# Altium schematic sheet FE.SchDoc: ThunderScope 1000E
size A4; Revision: 1
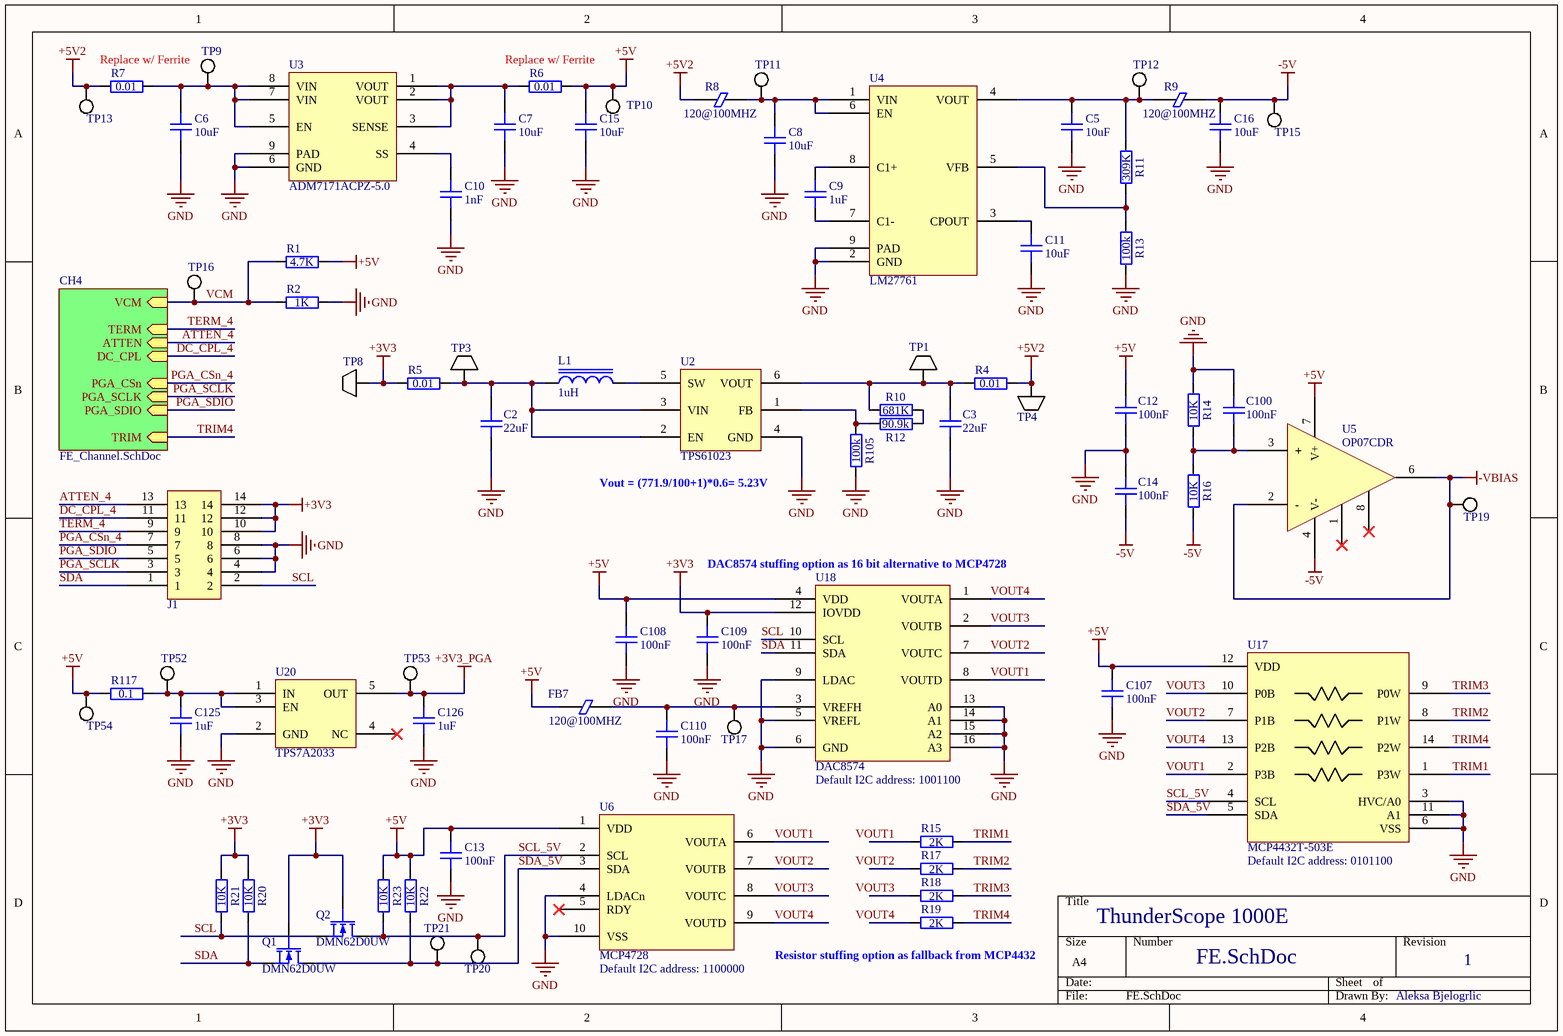
[diagram p0: FE.SchDoc]

## Parts
C2  22uF  [GEN_C_0805]
C3  22uF  [GEN_C_0805]
C5  10uF  [GEN_C_0603]
C6  10uF  [GEN_C_0603]
C7  10uF  [GEN_C_0603]
C8  10uF  [GEN_C_0603]
C9  1uF  [GEN_C_0402]
C10  1nF  [GEN_C_0402]
C11  10uF  [GEN_C_0603]
C12  100nF  [GEN_C_0402]
C13  100nF  [GEN_C_0402]
C14  100nF  [GEN_C_0402]
C15  10uF  [GEN_C_0603]
C16  10uF  [GEN_C_0603]
C100  100nF  [GEN_C_0402]
C107  100nF  [GEN_C_0402]
C108  100nF  [GEN_C_0402]
C109  100nF  [GEN_C_0402]
C110  100nF  [GEN_C_0402]
C125  1uF  [GEN_C_0402]
C126  1uF  [GEN_C_0402]
FB7  120@100MHZ  [GEN_R_0402]
J1  2.54mm 2X7 Pin TH  [GEN_2.54mm_2X7_Pin_TH_RA]  (value not drawn)
L1  1uH  [GEN_L_1210]
Q1  DMN62D0UW  [GEN_SOT_323]
Q2  DMN62D0UW  [GEN_SOT_323]
R1  4.7K  [GEN_R_0402]
R2  1K  [GEN_R_0402]
R4  0.01  [GEN_R_0603]
R5  0.01  [GEN_R_0603]
R6  0.01  [GEN_R_0603]
R7  0.01  [GEN_R_0603]
R8  120@100MHZ  [GEN_R_0402]
R9  120@100MHZ  [GEN_R_0402]
R10  681K  [GEN_R_0402]
R11  309K  [GEN_R_0402]
R12  90.9k  [GEN_R_0402]
R13  100k  [GEN_R_0402]
R14  10K  [GEN_R_0402]
R15  2K  [GEN_R_0402]
R16  10K  [GEN_R_0402]
R17  2K  [GEN_R_0402]
R18  2K  [GEN_R_0402]
R19  2K  [GEN_R_0402]
R20  10K  [GEN_R_0402]
R21  10K  [GEN_R_0402]
R22  10K  [GEN_R_0402]
R23  10K  [GEN_R_0402]
R105  100k  [GEN_R_0402]
R117  0.1  [GEN_R_0402]
TP1  5015  [KEY_5015]  (value not drawn)
TP3  5015  [KEY_5015]  (value not drawn)
TP4  5015  [KEY_5015]  (value not drawn)
TP8  5015  [KEY_5015]  (value not drawn)
TP9  PCB  [GEN_TP_PCB]  (value not drawn)  (no BOM)
TP10  PCB  [GEN_TP_PCB]  (value not drawn)  (no BOM)
TP11  PCB  [GEN_TP_PCB]  (value not drawn)  (no BOM)
TP12  PCB  [GEN_TP_PCB]  (value not drawn)  (no BOM)
TP13  PCB  [GEN_TP_PCB]  (value not drawn)  (no BOM)
TP15  PCB  [GEN_TP_PCB]  (value not drawn)  (no BOM)
TP16  PCB  [GEN_TP_PCB]  (value not drawn)  (no BOM)
TP17  PCB  [GEN_TP_PCB]  (value not drawn)  (no BOM)
TP19  PCB  [GEN_TP_PCB]  (value not drawn)  (no BOM)
TP20  PCB  [GEN_TP_PCB]  (value not drawn)  (no BOM)
TP21  PCB  [GEN_TP_PCB]  (value not drawn)  (no BOM)
TP52  PCB  [GEN_TP_PCB]  (value not drawn)  (no BOM)
TP53  PCB  [GEN_TP_PCB]  (value not drawn)  (no BOM)
TP54  PCB  [GEN_TP_PCB]  (value not drawn)  (no BOM)
U2  TPS61023  [TI_SOT563_DRL0006A]
U3  ADM7171ACPZ-5.0  [AD_DFN8_CP-8-21]
U4  LM27761  [TI_WSON8_DSG0008A]
U5  OP07CDR  [TI_SOIC8_D0008A]
U6  MCP4728  [MC_MSOP10_UN]
U17  MCP4432T-503E  [MC_TSSOP14]
U18  DAC8574  [TI_TSSOP16_PW0016A]
U20  TPS7A2033  [GEN_SOT23_5_950_2900X1600X1450]

## Sub-sheets
CH4 = FE_Channel.SchDoc: VCM (in), TRIM (in), ATTEN (in), DC_CPL (in), PGA_CSn (in), PGA_SCLK (in), PGA_SDIO (in), TERM (in)

## Nets
+3V3: C109.2 J1.10 J1.12 J1.14 Q1.2(G) Q2.2(G) R5.2 R20.2 R21.2 TP8.1 U18.12(IOVDD)
+3V3_PGA: C126.2 TP53.1 U20.5(OUT)
+5V: C12.1 C13.2 C15.2 C107.2 C108.2 FB7.2 R1.2 R6.2 R22.2 R23.2 R117.1 TP10.1 TP54.1 U5.7(V+) U6.1(VDD) U17.12(VDD) U18.4(VDD)
+5V2: R4.2 R7.1 R8.1 TP4.1 TP13.1
-5V: C14.2 C16.2 R9.2 R16.1 TP15.1 U5.4(V-)
-VBIAS: TP19.1 U5.2(-) U5.6(OUT)
GND: C2.1 C3.1 C5.1 C6.1 C7.1 C8.1 C10.1 C11.1 C12.2 C13.1 C14.1 C15.1 C16.1 C100.1 C107.1 C108.1 C109.1 C110.1 C125.1 C126.1 J1.4 J1.6 J1.8 R2.2 R13.1 R14.2 R105.1 U2.4(GND) U3.6(GND) U3.9(PAD) U4.2(GND) U4.9(PAD) U6.4(LDACn) U6.10(VSS) U17.3(HVC/A0) U17.6(VSS) U17.11(A1) U18.5(VREFL) U18.6(GND) U18.9(LDAC) U18.13(A0) U18.14(A1) U18.15(A2) U18.16(A3) U20.2(GND)
ATTEN_4: J1.13 ; sheet CH4/ATTEN
DC_CPL_4: J1.11 ; sheet CH4/DC_CPL
PGA_CSn_4: J1.7 ; sheet CH4/PGA_CSn
PGA_SCLK: J1.3 ; sheet CH4/PGA_SCLK
PGA_SDIO: J1.5 ; sheet CH4/PGA_SDIO
SCL: J1.2 Q2.3(S) R21.1 U18.10(SCL)
SCL_5V: Q2.1(D) R23.1 TP20.1 U6.2(SCL) U17.4(SCL)
SDA: J1.1 Q1.3(S) R20.1 U18.11(SDA)
SDA_5V: Q1.1(D) R22.1 TP21.1 U6.3(SDA) U17.5(SDA)
TERM_4: J1.9 ; sheet CH4/TERM
TRIM1: R15.1 U17.1(P3W)
TRIM2: R17.1 U17.8(P1W)
TRIM3: R18.1 U17.9(P0W)
TRIM4: R19.1 U17.14(P2W) ; sheet CH4/TRIM
VCM: R1.1 R2.1 TP16.1 ; sheet CH4/VCM
VOUT1: R15.2 U6.6(VOUTA) U17.2(P3B) U18.8(VOUTD)
VOUT2: R17.2 U6.7(VOUTB) U17.7(P1B) U18.7(VOUTC)
VOUT3: R18.2 U6.8(VOUTC) U17.10(P0B) U18.2(VOUTB)
VOUT4: R19.2 U6.9(VOUTD) U17.13(P2B) U18.1(VOUTA)
NetC2_2: C2.2 L1.1 R5.1 TP3.1 U2.2(EN) U2.3(VIN)
NetC3_2: C3.2 R4.1 R10.2 TP1.1 U2.6(VOUT)
NetC5_2: C5.2 R9.1 R11.2 TP12.1 U4.4(VOUT)
NetC6_2: C6.2 R7.2 TP9.1 U3.5(EN) U3.7(VIN) U3.8(VIN)
NetC7_2: C7.2 R6.1 U3.1(VOUT) U3.2(VOUT) U3.3(SENSE)
NetC8_2: C8.2 R8.2 TP11.1 U4.1(VIN) U4.6(EN)
NetC9_1: C9.1 U4.7(C1-)
NetC9_2: C9.2 U4.8(C1+)
NetC10_2: C10.2 U3.4(SS)
NetC11_2: C11.2 U4.3(CPOUT)
NetC100_2: C100.2 R14.1 R16.2 U5.3(+)
NetC110_2: C110.2 FB7.1 TP17.1 U18.3(VREFH)
NetC125_2: C125.2 R117.2 TP52.1 U20.1(IN) U20.3(EN)
NetL1_2: L1.2 U2.5(SW)
NetR10_1: R10.1 R12.2
NetR11_1: R11.1 R13.2 U4.5(VFB)
NetR12_1: R12.1 R105.2 U2.1(FB)

Not connected (* = marked no-connect by the designer): U5 1(N1)* 8(N2)*; U6 5(RDY)*; U20 4(NC)*

## Notes on the sheet
- (near TP9) Replace w/ Ferrite
- Replace w/ Ferrite
- (near U2) Vout = (771.9/100+1)*0.6= 5.23V
- (near U18) DAC8574 stuffing option as 16 bit alternative to MCP4728
- (near U18) Default I2C address: 1001100
- (near U17) Default I2C address: 0101100
- (near U6) Default I2C address: 1100000
- Resistor stuffing option as fallback from MCP4432
- Aleksa Bjelogrlic

## Library data of the parts
C2 C3 = CAP 22uF 25V X5R 0805: Voltage Rating: 25V; Package: 0805; Value: 22uF; Supplier 1: Digi-Key; Supplier Part Number 1: 490-10749-1-ND
C5-C8 C11 C15 C16 = CAP 10uF 10V X5R 0603: Voltage Rating: 10V; Package: 0402; Supplier 1: Digi-Key; Supplier Part Number 1: 490-10474-1-ND; Value: 10uF
C9 C125 C126 = CAP 1uF 25V X5R 0402: Voltage Rating: 25V; Package: 0402; Supplier 1: Digi-Key; Supplier Part Number 1: 490-10017-1-ND; Value: 1uF
C10 = CAP 1nF 50V C0G 0402: Voltage Rating: 50V; Package: 0402; Supplier 1: Digi-Key; Supplier Part Number 1: 490-6189-1-ND; Value: 1nF
C12-C14 C100 C107-C110 = CAP 100nF 16V X7R 0402: Voltage Rating: 16V; Package: 0402; Supplier 1: Digi-Key; Supplier Part Number 1: 490-4759-1-ND; Value: 100nF
FB7 = FERRITE BEAD 120 OHM 0402: Supplier 1: Digi-Key; Supplier Part Number 1: 490-9656-1-ND
J1 = CONN 2.54mm 2X7 Pin TH RA: Supplier 1: Digi-Key; Supplier Part Number 1: S9203-ND
L1 = IND 1uH 3.1A 45 MOHM 1210: Value: 1uH; Supplier 1: Digi-Key; Supplier Part Number 1: 490-10590-1-ND
Q1 Q2 = NMOS DMN62D0UW: Vdss: 60V; Id: 340mA; Max Power: 320mW; Supplier 1: Digi-Key; Supplier Part Number 1: DMN62D0UW-7DICT-ND
R1 = RES 4.7K OHM 1% 1/10W 0402: Manufacturer: Panasonic; Manufacturer Part Number: ERJ-2RKF4701X; Tolerance: 1%; Package: 0402; Supplier 1: Digi-Key; Supplier Part Number 1: P4.70KLCT-ND; Value: 4.7K
R2 = RES 1K OHM 1% 1/10W 0402: Manufacturer: Yageo; House Part Number: R-1K-0402-1%-001; Manufacturer Part Number: RC0402FR-071KL; Tolerance: 1%; Package: 0402; Value: 1K; Supplier 1: Digi-Key; Supplier Part Number 1: 311-1.00KLRCT-ND
R4-R7 = RES 0.01 OHM 1% 1/4W 0603: Tolerance: 1%; Power Rating: 0.25W; Supplier 1: Digi-Key; Supplier Part Number 1: 408-1404-1-ND; Value: 0.01; Package: 0603
R8 R9 = FERRITE BEAD 120 OHM 0402: Manufacturer: Murata; House Part Number: BLM15PX121SN1D; Supplier 1: Digi-Key; Supplier Part Number 1: 490-9656-1-ND; Manufacturer Part Number: BLM15PX121SN1D
R10 = RES 681K OHM 1% 1/16W 0402: Tolerance: 1%; Power Rating: 0.0625W; Package: 0402; Supplier 1: Digi-Key; Supplier Part Number 1: YAG3212CT-ND; Value: 681K
R11 = RES 309K OHM 1% 1/16W 0402: Tolerance: 1%; Power Rating: 0.0625W; Package: 0402; Supplier 1: Digi-Key; Supplier Part Number 1: YAG3108CT-ND; Value: 309K
R12 = RES 90.9K OHM 1% 1/16W 0402: Tolerance: 1%; Power Rating: 0.0625W; Package: 0402; Supplier 1: Digi-Key; Supplier Part Number 1: 311-90.9KLRCT-ND; Value: 90.9k
R13 R105 = RES 100K OHM 1% 1/10W 0402: Tolerance: 1%; Power Rating: 0.1W; Package: 0402; Supplier 1: Digi-Key; Supplier Part Number 1: 311-100KLRCT-ND; Value: 100k
R14 R16 R20-R23 = RES 10K OHM 1% 1/10W 0402: Tolerance: 1%; Power Rating: 0.1W; Package: 0402; Supplier 1: Digi-Key; Supplier Part Number 1: P10.0KLCT-ND; Value: 10K
R15 R17-R19 = RES 2K OHM 1% 1/16W 0402: Tolerance: 1%; Power Rating: 0.0625W; Package: 0402; Supplier 1: Digi-Key; Supplier Part Number 1: 311-2KLRCT-ND; Value: 2K
R117 = RES 0.1 OHM 1% 1/6W 0402: Tolerance: 1%; Power Rating: 0.16W; Package: 0402; Supplier 1: Digi-Key; Supplier Part Number 1: P.10AKCT-ND; Value: 0.1
TP1 TP3 TP4 TP8 = TP KEYSTONE 5015: Supplier 1: Digi-Key; Supplier Part Number 1: 36-5015CT-ND
TP9-TP13 TP15-TP17 TP19-TP21 TP52-TP54 = TP PCB 1mm
U2 = IC BOOST TPS61023: Supplier 1: Digi-Key; Supplier Part Number 1: 296-TPS61023DRLTCT-ND
U3 = IC LDO ADM7171ACPZ-5.0: Supplier 1: Digi-Key; Supplier Part Number 1: 505-ADM7171ACPZ-5.0-R7CT-ND
U4 = IC CPUMP LM27761: Supplier 1: Digi-Key; Supplier Part Number 1: 296-44379-1-ND
U5 = IC OPAMP OP07CDR: Supplier 1: Digi-Key; Supplier Part Number 1: 296-14626-1-ND
U6 = IC DAC QUAD MCP4728: Supplier 1: Digi-Key; Supplier Part Number 1: MCP4728A1T-E/UNCT-ND
U17 = IC DIGIPOT QUAD MCP4432T-503E: Supplier 1: Mouser; Supplier Part Number 1: 579-MCP4432T-503E/ST
U18 = IC DAC QUAD DAC8574: Supplier 1: Texas Instruments; Supplier Part Number 1: DAC8574IPWR
U20 = IC LDO TPS7A2033: Manufacturer: Texas Instruments; Manufacturer Part Number: TPS7A2033PDBVR; Supplier 1: Mouser; Supplier Part Number 1: 595-TPS7A2033PDBVR